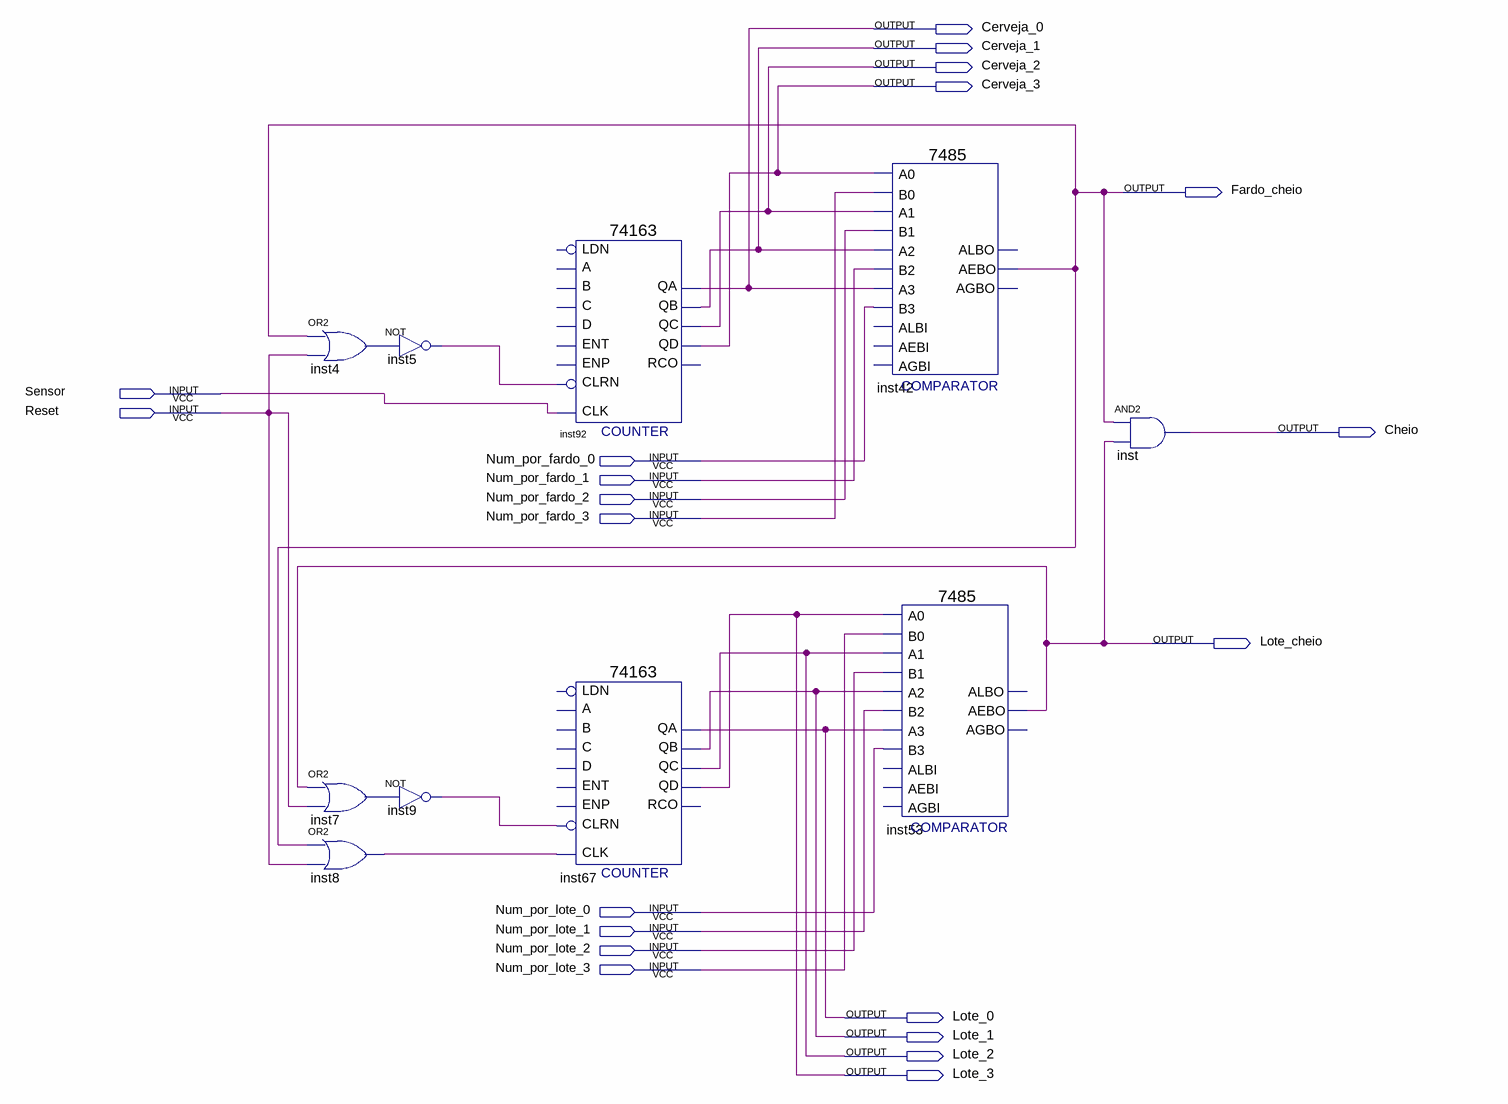
[diagram p0: schematic sheet]
// Quartus schematic cerveja.bdf as structural Verilog: 10 symbols, 21 pins
module cerveja (
  input  Sensor,
  input  Reset,
  input  Num_por_fardo_0,
  input  Num_por_fardo_1,
  input  Num_por_fardo_2,
  input  Num_por_fardo_3,
  input  Num_por_lote_0,
  input  Num_por_lote_1,
  input  Num_por_lote_2,
  input  Num_por_lote_3,
  output Cerveja_0,
  output Cerveja_1,
  output Cerveja_2,
  output Cerveja_3,
  output Fardo_cheio,
  output Cheio,
  output Lote_cheio,
  output Lote_0,
  output Lote_1,
  output Lote_2,
  output Lote_3
);

  wire inst4_out, inst5_out, inst7_out, inst8_out, inst9_out;

  or inst4 (inst4_out, Fardo_cheio, Reset);
  or inst7 (inst7_out, Lote_cheio, Reset);
  or inst8 (inst8_out, Fardo_cheio, Reset);
  not inst5 (inst5_out, inst4_out);
  not inst9 (inst9_out, inst7_out);
  \74163  inst92 (
    .CLRN(inst5_out), .CLK(Sensor), .QA(Cerveja_0), .QB(Cerveja_1), .QC(Cerveja_2), .QD(Cerveja_3));  // open: C, B, A, ENT, D, ENP, LDN, RCO
  \74163  inst67 (
    .CLRN(inst9_out), .CLK(inst8_out), .QA(Lote_0), .QB(Lote_1), .QC(Lote_2), .QD(Lote_3));  // open: C, B, A, ENT, D, ENP, LDN, RCO
  \7485  inst42 (
    .A3(Cerveja_0), .B2(Num_por_fardo_1), .A2(Cerveja_1), .A0(Cerveja_3), .B0(Num_por_fardo_3),
    .B3(Num_por_fardo_0), .A1(Cerveja_2), .B1(Num_por_fardo_2), .AEBO(Fardo_cheio));  // open: AEBI, AGBI, ALBI, ALBO, AGBO
  \7485  inst53 (
    .A3(Lote_0), .B2(Num_por_lote_1), .A2(Lote_1), .A0(Lote_3), .B0(Num_por_lote_3), .B3(Num_por_lote_0),
    .A1(Lote_2), .B1(Num_por_lote_2), .AEBO(Lote_cheio));  // open: AEBI, AGBI, ALBI, ALBO, AGBO
  and inst (Cheio, Fardo_cheio, Lote_cheio);
endmodule
